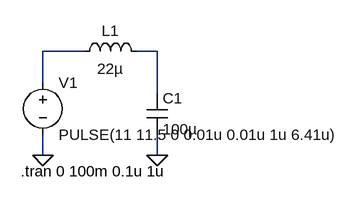
[diagram p0: schematic LC_Filter.asc]
LC_Filter.asc, the LTspice schematic file:
Version 4
SHEET 1 880 680
WIRE 96 128 32 128
WIRE 208 128 176 128
WIRE 32 176 32 128
WIRE 208 192 208 128
WIRE 32 288 32 256
WIRE 208 288 208 256
FLAG 208 288 0
FLAG 32 288 0
SYMBOL ind 80 144 R270
WINDOW 0 32 56 VTop 0
WINDOW 3 5 56 VBottom 0
SYMATTR InstName L1
SYMATTR Value 22µ
SYMBOL cap 192 192 R0
SYMATTR InstName C1
SYMATTR Value 100µ
SYMBOL voltage 32 160 R0
WINDOW 123 0 0 Left 0
WINDOW 39 0 0 Left 0
SYMATTR InstName V1
SYMATTR Value PULSE(11 11.5 0 0.01u 0.01u 1u 6.41u)
TEXT -2 312 Left 0 !.tran 0 100m 0.1u 1u

The netlist it stands for:
* LC_Filter.asc
L1 N001 N002 22µ
C1 N002 0 100µ
V1 N001 0 PULSE(11 11.5 0 0.01u 0.01u 1u 6.41u)
.tran 0 100m 0.1u 1u
.backanno
.end